# EAGLE schematic LH_010 (EAGLE 7.3.0)
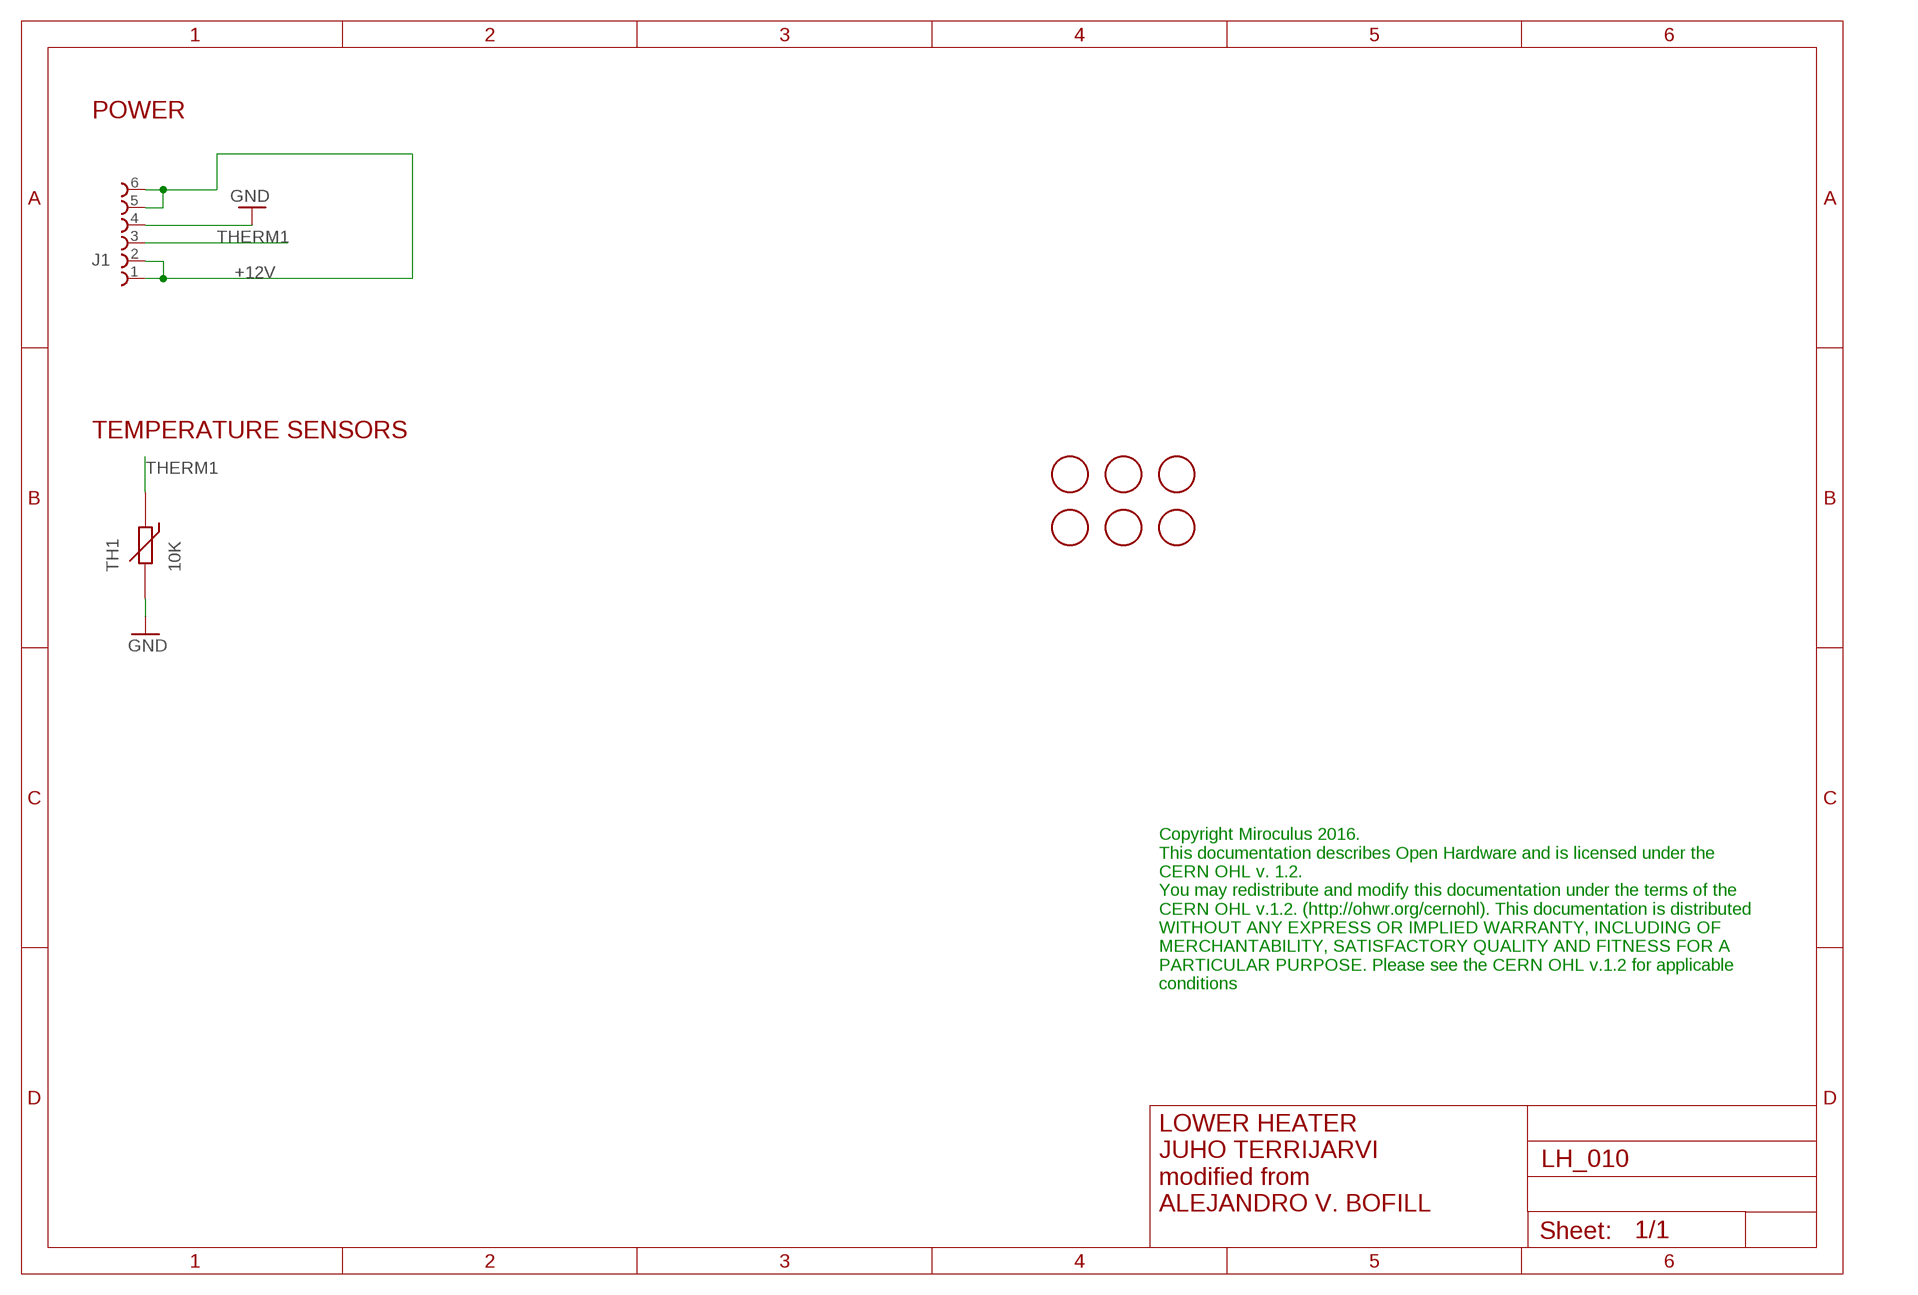
[diagram p0: schematic, sheet 1]

## Parts
FD1  FIDUCIALMOUNT  [FIDUCIA-MOUNT]
FD2  FIDUCIALMOUNT  [FIDUCIA-MOUNT]
FD3  FIDUCIALMOUNT  [FIDUCIA-MOUNT]
FD4  FIDUCIALMOUNT  [FIDUCIA-MOUNT]
FD5  FIDUCIALMOUNT  [FIDUCIA-MOUNT]
FD6  FIDUCIALMOUNT  [FIDUCIA-MOUNT]
J1  68710614522  [68710614522]
TH1  10K  THERMISTOR_SMD_0603  [THERMISTOR_SMD_0603]

## Nets
+12V: J1.1 J1.2 J1.5 J1.6
GND [gnd]: J1.4 TH1.2
THERM1: J1.3 TH1.1

## Notes on the sheet
- POWER
- TEMPERATURE SENSORS
- Copyright Miroculus 2016.
  This documentation describes Open Hardware and is licensed under the
  CERN OHL v. 1.2.
  You may redistribute and modify this documentation under the terms of the
  CERN OHL v.1.2. (http://ohwr.org/cernohl). This documentation is distributed
  WITHOUT ANY EXPRESS OR IMPLIED WARRANTY, INCLUDING OF
  MERCHANTABILITY, SATISFACTORY QUALITY AND FITNESS FOR A
  PARTICULAR PURPOSE. Please see the CERN OHL v.1.2 for applicable
  conditions
- LOWER HEATER
  JUHO TERRIJARVI
  modified from
  ALEJANDRO V. BOFILL

## Library data of the parts
FD1-FD6 = SmartPrj:FIDUCIALMOUNT
J1 = Eagle_FPC_CONNECTOR_AND_FFC_CAB (rev18c):68710614522: WE-FPC 0.5mm SMT ZIF Horizontal Bottom Contact, 6 Pins=>Code : Con_FPC_ZIF_0.50_68710614522 <http://katalog.we-online.de/media/images/eican/Con_FPC_ZIF_0.50_6871xx14522_pf2.jpg> Details see: http://katalog.we-online.de/en/em/687_1xx_145_22 Created 2014-07-09, Karrer Zheng 2014 (C) Würth Elektronik
TH1 = Miroculus:THERMISTOR_SMD_0603

## Net classes
0 default: width 0.254 mm, drill 0.406 mm, clearance 0.178 mm
1 power: width 0.254 mm, drill 0.406 mm, clearance 0.178 mm
2 gnd: width 0.254 mm, drill 0.406 mm, clearance 0.178 mm
3 power usb: width 0.254 mm, drill 0.406 mm, clearance 0.178 mm